# EAGLE schematic jbbs (EAGLE 6.6.0)
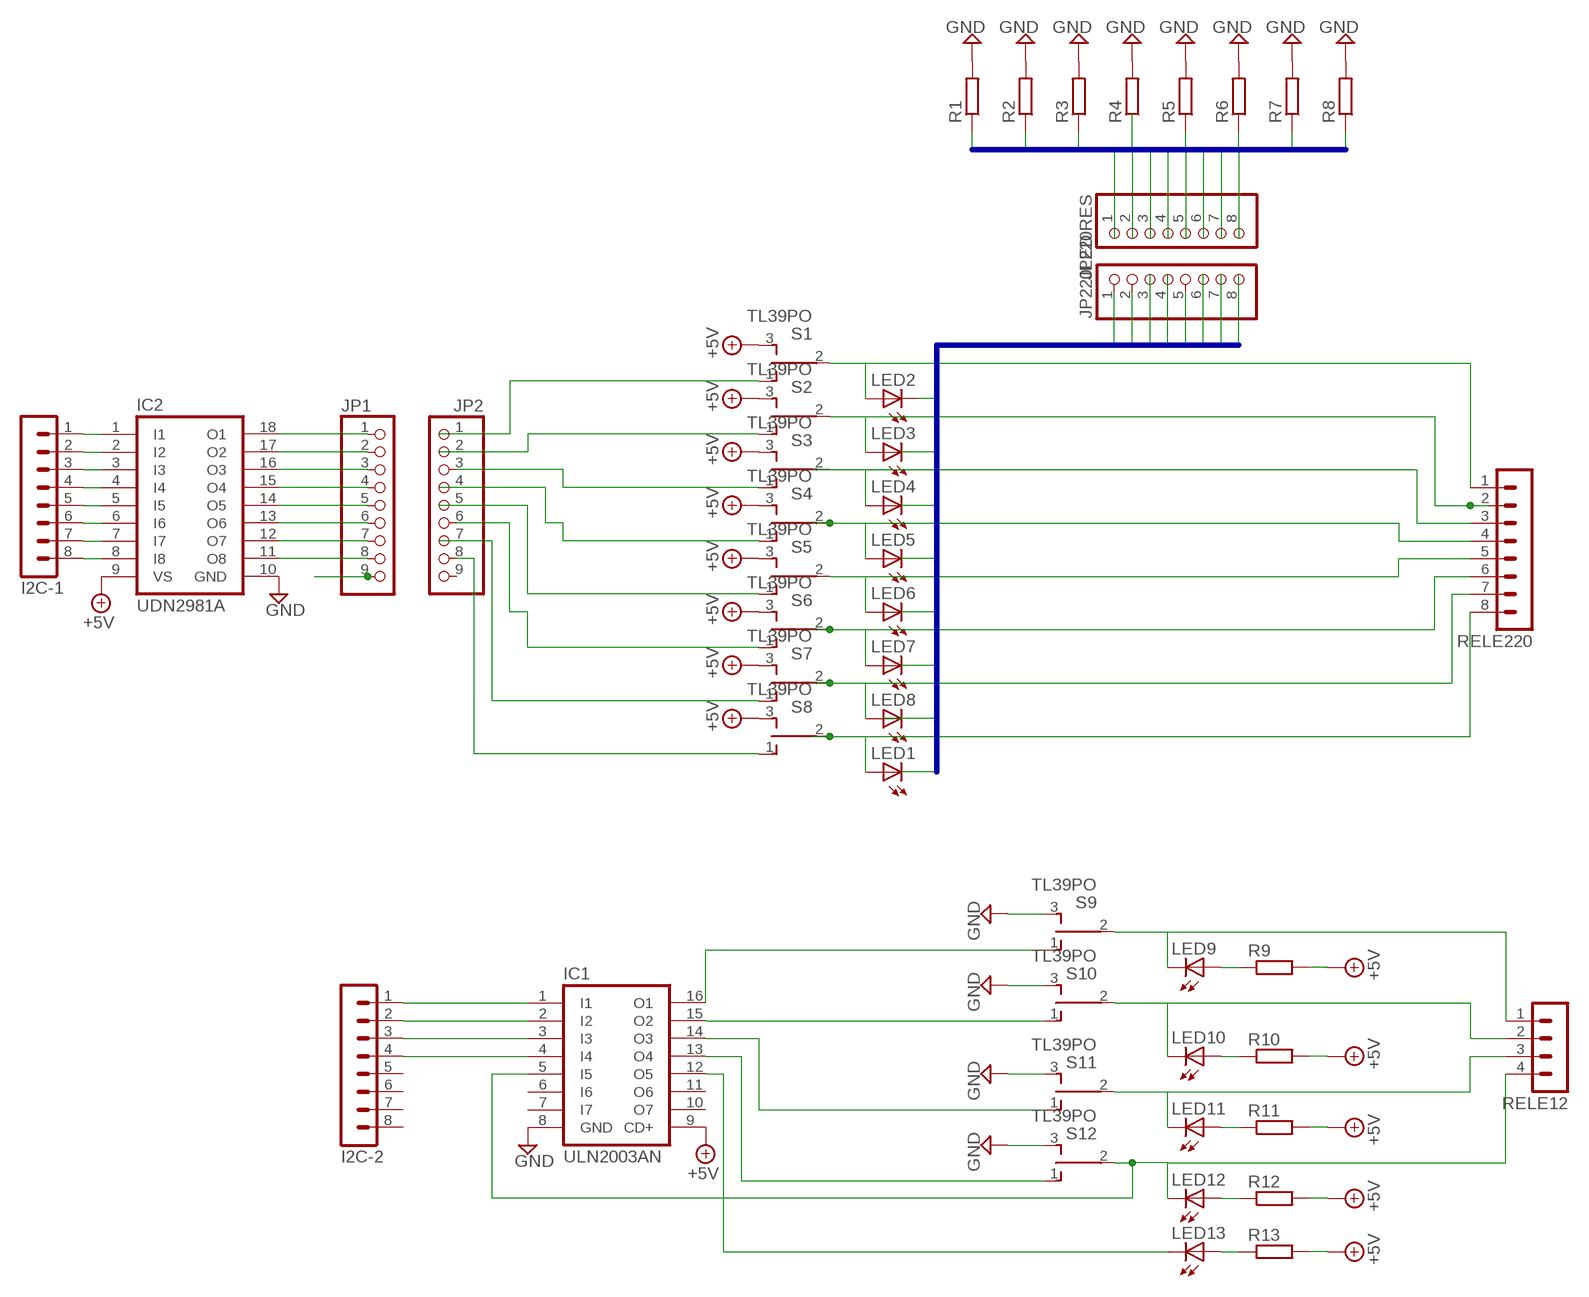
[diagram p0: schematic, sheet 1]

## Parts
I2C-1  MA08-1  [MA08-1]
I2C-2  MA08-1  [MA08-1]
IC1  ULN2003AN  [DIL16]
IC2  UDN2981A  [DIL18]
JP1  PINHD-1X9  [1X09]
JP2  PINHD-1X9  [1X09]
JP220LED  PINHD-1X8  [1X08]
JP220RES  PINHD-1X8  [1X08]
LED1  LED5MM  [LED5MM]
LED2  LED5MM  [LED5MM]
LED3  LED5MM  [LED5MM]
LED4  LED5MM  [LED5MM]
LED5  LED5MM  [LED5MM]
LED6  LED5MM  [LED5MM]
LED7  LED5MM  [LED5MM]
LED8  LED5MM  [LED5MM]
LED9  LED5MM  [LED5MM]
LED10  LED5MM  [LED5MM]
LED11  LED5MM  [LED5MM]
LED12  LED5MM  [LED5MM]
LED13  LED5MM  [LED5MM]
R1  R-EU_0204/7  [0204/7]
R2  R-EU_0204/7  [0204/7]
R3  R-EU_0204/7  [0204/7]
R4  R-EU_0204/7  [0204/7]
R5  R-EU_0204/7  [0204/7]
R6  R-EU_0204/7  [0204/7]
R7  R-EU_0204/7  [0204/7]
R8  R-EU_0204/7  [0204/7]
R9  R-EU_0204/7  [0204/7]
R10  R-EU_0204/7  [0204/7]
R11  R-EU_0204/7  [0204/7]
R12  R-EU_0204/7  [0204/7]
R13  R-EU_0204/7  [0204/7]
RELE12  MA04-1  [MA04-1]
RELE220  MA08-1  [MA08-1]
S1  TL39PO  [TL3XPO]
S2  TL39PO  [TL3XPO]
S3  TL39PO  [TL3XPO]
S4  TL39PO  [TL3XPO]
S5  TL39PO  [TL3XPO]
S6  TL39PO  [TL3XPO]
S7  TL39PO  [TL3XPO]
S8  TL39PO  [TL3XPO]
S9  TL39PO  [TL3XPO]
S10  TL39PO  [TL3XPO]
S11  TL39PO  [TL3XPO]
S12  TL39PO  [TL3XPO]

## Nets
220LED1: JP220LED.1
220LED2: JP220LED.2
220LED5: JP220LED.5
220LED8: LED2.K(C)
220RES1: R1.1
220RES2: R2.1
220RES3: R3.1
220RES5: R5.1
220RES6: R6.1
220RES7: R7.1
220RES8: R8.1
+5V: IC1.9(CD+) IC2.9(VS) R9.2 R10.2 R11.2 R12.2 R13.2 S1.3(S) S2.3(S) S3.3(S) S4.3(S) S5.3(S) S6.3(S) S7.3(S) S8.3(S)
GND: IC1.8(GND) IC2.10(GND) R1.2 R2.2 R3.2 R4.2 R5.2 R6.2 R7.2 R8.2 S9.3(S) S10.3(S) S11.3(S) S12.3(S)
N$1: LED2.A RELE220.1 S1.2(P)
N$2: I2C-1.1 IC2.1(I1)
N$3: I2C-1.2 IC2.2(I2)
N$4: I2C-1.3 IC2.3(I3)
N$5: I2C-1.4 IC2.4(I4)
N$6: I2C-1.5 IC2.5(I5)
N$7: I2C-1.6 IC2.6(I6)
N$8: I2C-1.7 IC2.7(I7)
N$9: I2C-1.8 IC2.8(I8)
N$10: I2C-2.1 IC1.1(I1)
N$11: I2C-2.2 IC1.2(I2)
N$12: I2C-2.3 IC1.3(I3)
N$13: I2C-2.4 IC1.4(I4)
N$14: LED13.A R13.1
N$15: IC1.12(O5) LED13.K(C)
N$16: IC2.18(O1) JP1.1
N$17: LED3.A RELE220.2 S2.2(P)
N$18: LED4.A RELE220.3 S3.2(P)
N$19: LED5.A RELE220.4 S4.2(P)
N$20: LED6.A RELE220.5 S5.2(P)
N$21: LED7.A RELE220.6 S6.2(P)
N$22: LED8.A RELE220.7 S7.2(P)
N$23: LED1.A RELE220.8 S8.2(P)
N$24: IC2.17(O2) JP1.2
N$25: IC2.16(O3) JP1.3
N$26: IC2.15(O4) JP1.4
N$27: IC2.14(O5) JP1.5
N$28: IC2.13(O6) JP1.6
N$29: IC2.12(O7) JP1.7
N$30: IC2.11(O8) JP1.8
N$31: S1.1(O)
N$32: JP1.9
N$40: IC1.13(O4) S12.1(O)
N$41: IC1.16(O1) S9.1(O)
N$42: IC1.15(O2) S10.1(O)
N$43: IC1.14(O3) S11.1(O)
N$44: LED9.A R9.1
N$45: LED10.A R10.1
N$46: LED11.A R11.1
N$47: LED12.A R12.1
N$48: LED9.K(C) RELE12.1 S9.2(P)
N$49: LED10.K(C) RELE12.2 S10.2(P)
N$50: LED11.K(C) RELE12.3 S11.2(P)
N$51: IC1.5(I5) LED12.K(C) RELE12.4 S12.2(P)
N$52: S2.1(O)
N$53: JP2.3 S3.1(O)
N$54: S4.1(O)
N$55: JP2.5 S5.1(O)
N$56: JP2.6 S6.1(O)
N$57: S7.1(O)
N$58: JP2.8 S8.1(O)
Unconnected: I2C-2.5 I2C-2.6 I2C-2.7 I2C-2.8 IC1.6(I6) IC1.7(I7) IC1.10(O7) IC1.11(O6) JP2.1 JP2.2 JP2.4 JP2.7 JP2.9 JP220LED.3 JP220LED.4 JP220LED.6 JP220LED.7 JP220LED.8 JP220RES.1 JP220RES.2 JP220RES.3 JP220RES.4 JP220RES.5 JP220RES.6 JP220RES.7 JP220RES.8 LED1.K(C) LED3.K(C) LED4.K(C) LED5.K(C) LED6.K(C) LED7.K(C) LED8.K(C) R4.1

## Buses
220LED[1..8]
220RES[1..8]

## Library data of the parts
I2C-1 I2C-2 RELE220 = con-lstb:MA08-1: PIN HEADER; OC_FARNELL: unknown; OC_NEWARK: unknown
IC1 = uln-udn:ULN2003A: DRIVER ARRAY
IC2 = uln-udn:UDN298*: DRIVER ARRAY Source: Allegro Microsystems Inc. / UDN2981-UDN2984.pdf
JP1 JP2 = pinhead:PINHD-1X9: PIN HEADER
JP220LED JP220RES = pinhead:PINHD-1X8: PIN HEADER
LED1-LED13 = led:LED: LED OSRAM: - CHIPLED LG R971, LG N971, LY N971, LG Q971, LY Q971, LO R971, LY R971 LH N974, LH R974 LS Q976, LO Q976, LY Q976 LO Q996 - Hyper CHIPLED LW Q18S LB Q993, LB Q99A, LB R99A - SideLED LS A670, LO A670, LY A670, LG A670, LP A670 LB A673, LV A673, LT A673, LW A673 LH A674 LY A675 LS A676, LA A676, LO A676, LY A676, LW A676 LS A679, LY A679, LG A679 - Hyper Micro SIDELED® LS Y876, LA Y876, LO Y876, LY Y876 LT Y87S - SmartLED LW L88C, LW L88S LB L89C, LB L89S, LG L890 LS L89K, LO L89K, LY L89K LS L896, LA L896, LO L896, LY L896 - TOPLED LS T670, LO T670, LY T670, LG T670, LP T670 LSG T670, LSP T670, LSY T670, LOP T670, LYG T670 LG T671, LOG T671, LSG T671 LB T673, LV T673, LT T673, LW T673 LH T674 LS T676, LA T676, LO T676, LY T676, LB T676, LH T676, LSB T676, LW T676 LB T67C, LV T67C, LT T67C, LS T67K, LO T67K, LY T67K, LW E67C LS E67B, LA E67B, LO E67B, LY E67B, LB E67C, LV E67C, LT E67C LW T67C LS T679, LY T679, LG T679 LS T770, LO T770, LY T770, LG T770, LP T770 LB T773, LV T773, LT T773, LW T773 LH T774 LS E675, LA E675, LY E675, LS T675 LS T776, LA T776, LO T776, LY T776, LB T776 LHGB T686 LT T68C, LB T68C - Hyper Mini TOPLED® LB M676 - Mini TOPLED Santana® LG M470 LS M47K, LO M47K, LY M47K Source: http://www.osram.convergy.de LUXEON: - LUMILED® LXK2-PW12-R00, LXK2-PW12-S00, LXK2-PW14-U00, LXK2-PW14-V00 LXK2-PM12-R00, LXK2-PM12-S00, LXK2-PM14-U00 LXK2-PE12-Q00, LXK2-PE12-R00, LXK2-PE12-S00, LXK2-PE14-T00, LXK2-PE14-U00 LXK2-PB12-K00, LXK2-PB12-L00, LXK2-PB12-M00, LXK2-PB14-N00, LXK2-PB14-P00, LXK2-PB14-Q00 LXK2-PR12-L00, LXK2-PR12-M00, LXK2-PR14-Q00, LXK2-PR14-R00 LXK2-PD12-Q00, LXK2-PD12-R00, LXK2-PD12-S00 LXK2-PH12-R00, LXK2-PH12-S00 LXK2-PL12-P00, LXK2-PL12-Q00, LXK2-PL12-R00 Source: www.luxeon.com KINGBRIGHT: KA-3528ASYC Source: www.kingbright.com
R1-R13 = resistor:R-EU_: RESISTOR, European symbol
RELE12 = con-lstb:MA04-1: PIN HEADER; OC_FARNELL: unknown; OC_NEWARK: unknown
S1-S12 = switch:TL39PO: TINY SWITCH ON OFF ON Source: http://www2.produktinfo.conrad.com/datenblaetter/700000-724999/705152-da-01-de-Subminiaturschalter_TL_36YO.pdf